# Altium project BeagleShield.PrjPcb
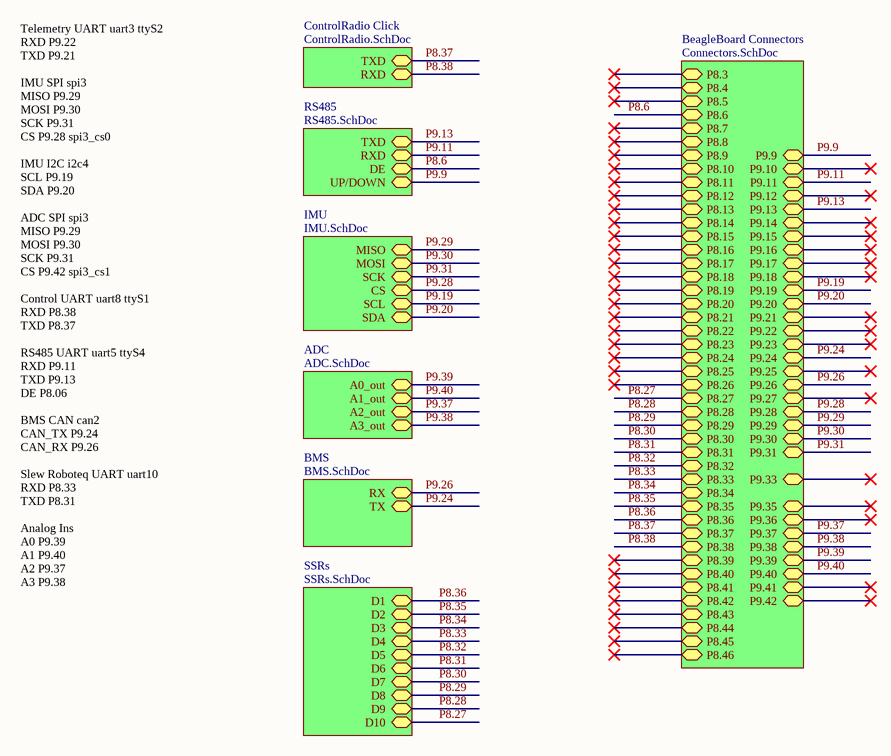
[diagram p0: Main.SchDoc]
6 sheets, 32 parts. Net scope: hierarchical (ports join the sheet entries above them; power ports are global).
Board file: Main.PcbDoc
Sheets:
  Main.SchDoc
  RS485Click.SchDoc
  TelemetryClick.SchDoc
  ADCClick.SchDoc
  Beagle.SchDoc
  ControlRadioClick.SchDoc

## Sheet Main.SchDoc
size A

### Sub-sheets
ADC = ADC.SchDoc (file not in this document): A2_out, A3_out, A0_out, A1_out
BeagleBoard Connectors = Connectors.SchDoc (file not in this document): P9.42, P9.17, P8.18, P9.21, P8.32, P9.33, P9.23, P8.28, P9.19, P9.16, P9.12, P9.31, P8.26, P9.15, P8.41, P9.36, P8.46, P8.36, P9.14, P8.12, P9.13, P9.20, P9.11, P8.20, P9.40, P8.24, P9.28, P9.30, P9.24, P9.22, P9.18, P8.22, P8.16, P8.44, P9.38, P8.38, P8.34, P9.26, P8.43, P9.25, P8.42, P9.41, P9.35, P9.27, P9.37, P9.39, P8.10, P8.30, P8.14, P8.45, P8.6, P9.29, P9.10, P8.4, P9.9, P8.8, P8.40, P8.5, P8.27, P8.3, P8.21, P8.7, P8.39, P8.19, P8.17, P8.15, P8.13, P8.35, P8.33, P8.37, P8.23, P8.9, P8.11, P8.25, P8.31, P8.29
BMS = BMS.SchDoc (file not in this document): RX, TX
ControlRadio Click = ControlRadio.SchDoc (file not in this document): TXD, RXD
IMU = IMU.SchDoc (file not in this document): MISO, MOSI, SCK, CS, SCL, SDA
RS485 = RS485.SchDoc (file not in this document): TXD, RXD, DE, UP/DOWN
SSRs = SSRs.SchDoc (file not in this document): D1, D2, D3, D4, D5, D6, D7, D8, D9, D10

### Nets
P8.6: sheet RS485/DE, sheet BeagleBoard Connectors/P8.6
P8.27: sheet BeagleBoard Connectors/P8.27, sheet SSRs/D10
P8.28: sheet BeagleBoard Connectors/P8.28, sheet SSRs/D9
P8.29: sheet BeagleBoard Connectors/P8.29, sheet SSRs/D8
P8.30: sheet BeagleBoard Connectors/P8.30, sheet SSRs/D7
P8.31: sheet BeagleBoard Connectors/P8.31, sheet SSRs/D6
P8.32: sheet BeagleBoard Connectors/P8.32, sheet SSRs/D5
P8.33: sheet BeagleBoard Connectors/P8.33, sheet SSRs/D4
P8.34: sheet BeagleBoard Connectors/P8.34, sheet SSRs/D3
P8.35: sheet BeagleBoard Connectors/P8.35, sheet SSRs/D2
P8.36: sheet BeagleBoard Connectors/P8.36, sheet SSRs/D1
P8.37: sheet BeagleBoard Connectors/P8.37, sheet ControlRadio Click/TXD
P8.38: sheet BeagleBoard Connectors/P8.38, sheet ControlRadio Click/RXD
P9.9: sheet RS485/UP/DOWN, sheet BeagleBoard Connectors/P9.9
P9.11: sheet RS485/RXD, sheet BeagleBoard Connectors/P9.11
P9.13: sheet RS485/TXD, sheet BeagleBoard Connectors/P9.13
P9.19: sheet IMU/SCL, sheet BeagleBoard Connectors/P9.19
P9.20: sheet IMU/SDA, sheet BeagleBoard Connectors/P9.20
P9.24: sheet BeagleBoard Connectors/P9.24, sheet BMS/TX
P9.26: sheet BeagleBoard Connectors/P9.26, sheet BMS/RX
P9.28: sheet IMU/CS, sheet BeagleBoard Connectors/P9.28
P9.29: sheet IMU/MISO, sheet BeagleBoard Connectors/P9.29
P9.30: sheet IMU/MOSI, sheet BeagleBoard Connectors/P9.30
P9.31: sheet IMU/SCK, sheet BeagleBoard Connectors/P9.31
P9.37: sheet ADC/A2_out, sheet BeagleBoard Connectors/P9.37
P9.38: sheet ADC/A3_out, sheet BeagleBoard Connectors/P9.38
P9.39: sheet ADC/A0_out, sheet BeagleBoard Connectors/P9.39
P9.40: sheet ADC/A1_out, sheet BeagleBoard Connectors/P9.40

### Notes on the sheet
- Telemetry UART uart3 ttyS2
  RXD P9.22
  TXD P9.21
  IMU SPI spi3
  MISO P9.29
  MOSI P9.30
  SCK P9.31
  CS P9.28 spi3_cs0
  IMU I2C i2c4
  SCL P9.19
  SDA P9.20
  ADC SPI spi3
  MISO P9.29
  MOSI P9.30
  SCK P9.31
  CS P9.42 spi3_cs1
  Control UART uart8 ttyS1
  RXD P8.38
  TXD P8.37
  RS485 UART uart5 ttyS4
  RXD P9.11
  TXD P9.13
  DE P8.06
  BMS CAN can2
  CAN_TX P9.24
  CAN_RX P9.26
  Slew Roboteq UART uart10
  RXD P8.33
  TXD P8.31
  Analog Ins
  A0 P9.39
  A1 P9.40
  A2 P9.37
  A3 P9.38

## Sheet RS485Click.SchDoc
size A
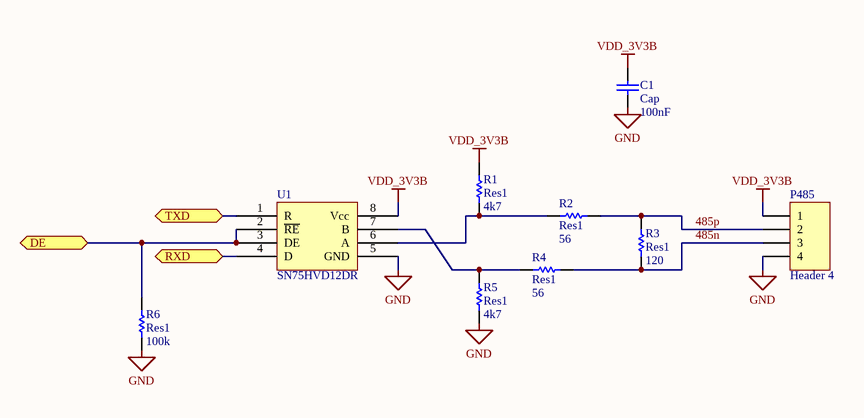
[diagram p1: RS485Click.SchDoc]

### Parts
C1  Cap  value 100nF  [RAD-0.3]
P485  Header 4  [HDR1X4]
R1  Res1  value 4k7  [AXIAL-0.3]
R2  Res1  value 56  [AXIAL-0.3]
R3  Res1  value 120  [AXIAL-0.3]
R4  Res1  value 56  [AXIAL-0.3]
R5  Res1  value 4k7  [AXIAL-0.3]
R6  Res1  value 100k  [AXIAL-0.3]
U1  SN75HVD12DR  [SOIC127P599X175-8N]

### Ports
DE, RXD, TXD

### Nets
GND: C1.1 P485.4 R5.2 R6.2 U1.5(GND)
VDD_3V3B: C1.2 P485.1 R1.1 U1.8(Vcc)
485n: P485.3 R3.1 R4.1
485p: P485.2 R2.1 R3.2
NetR1_2: R1.2 R2.2 U1.6(A)
NetR4_2: R4.2 R5.1 U1.7(B)
NetR6_1: R6.1 U1.2(~{RE}) U1.3(DE) ; port DE
NetU1_1: U1.1(R) ; port TXD
NetU1_4: U1.4(D) ; port RXD

### Library data of the parts
C1 = Cap: Capacitor; Published: 8-Jun-2000; LatestRevisionDate: 17-Jul-2002; LatestRevisionNote: Re-released for DXP Platform.; PackageReference: RAD-0.3; Publisher: Altium Limited; PackageDescription: Radial Cap, Thru-Hole; 2 Leads; 0.3 in Pin Spacing
P485 = Header 4: Header, 4-Pin; LatestRevisionDate: 17-Jul-2002; LatestRevisionNote: Re-released for DXP Platform.; Publisher: Altium Limited
R1-R6 = Res1: Resistor; Published: 8-Jun-2000; LatestRevisionDate: 17-Jul-2002; LatestRevisionNote: Re-released for DXP Platform.; PackageReference: AXIAL-0.3; Publisher: Altium Limited; PackageDescription: Axial Device, Thru-Hole; 2 Leads; 0.3 in Pin Spacing
U1 = SN75HVD12DR: Vendor Part Number: 296-26658-1-ND; Vendor: Digikey; Manufacturer Part Number: SN75HVD12DR

## Sheet TelemetryClick.SchDoc
size A
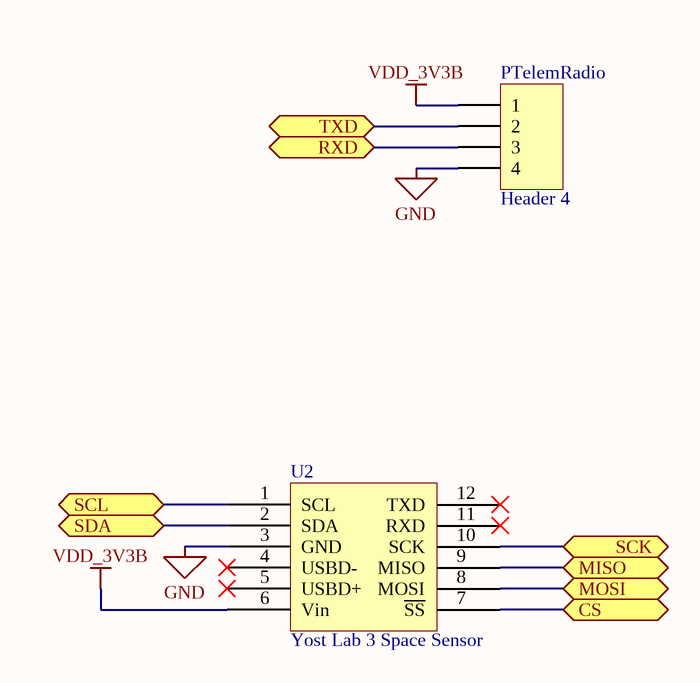
[diagram p2: TelemetryClick.SchDoc]

### Parts
PTelemRadio  Header 4  [HDR1X4]
U2  Yost Lab 3 Space Sensor  [Yost 3 Space Sensor]

### Ports
CS, MISO, MOSI, RXD, SCK, SCL, SDA, TXD

### Nets
GND: PTelemRadio.4 U2.3(GND)
VDD_3V3B: PTelemRadio.1 U2.6(Vin)
NetPTelemRadio_2: PTelemRadio.2 ; port TXD
NetPTelemRadio_3: PTelemRadio.3 ; port RXD
NetU2_1: U2.1(SCL) ; port SCL
NetU2_2: U2.2(SDA) ; port SDA
NetU2_7: U2.7(~{SS}) ; port CS
NetU2_8: U2.8(MOSI) ; port MOSI
NetU2_9: U2.9(MISO) ; port MISO
NetU2_10: U2.10(SCK) ; port SCK

Not connected (* = marked no-connect by the designer): U2 4(USBD-)* 5(USBD+)* 11(RXD)* 12(TXD)*

### Library data of the parts
PTelemRadio = Header 4: Header, 4-Pin; LatestRevisionDate: 17-Jul-2002; LatestRevisionNote: Re-released for DXP Platform.; Publisher: Altium Limited
U2 = Yost Lab 3 Space Sensor: Manufacturer Part Number: Yost Lab 3 Space Sensor

## Sheet ADCClick.SchDoc
size A
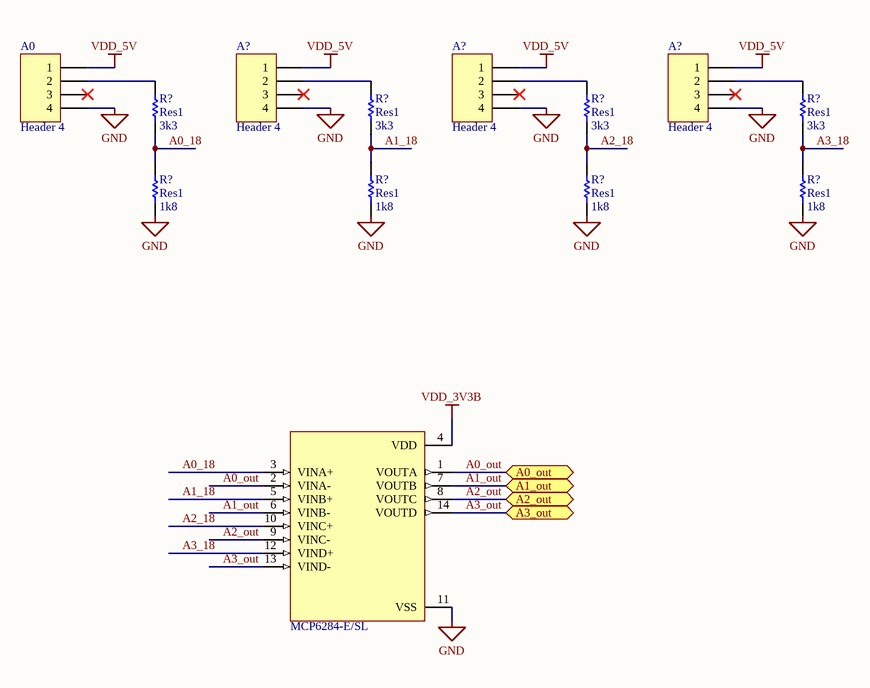
[diagram p3: ADCClick.SchDoc]

### Parts
(Parts that share a designator on the sheet are numbered #1, #2 ... from top to bottom, then left to right.)
A0  Header 4  [HDR1X4]
A?#1  Header 4  [HDR1X4]
A?#2  Header 4  [HDR1X4]
A?#3  Header 4  [HDR1X4]
R?#1  Res1  value 3k3  [AXIAL-0.3]
R?#2  Res1  value 3k3  [AXIAL-0.3]
R?#3  Res1  value 3k3  [AXIAL-0.3]
R?#4  Res1  value 3k3  [AXIAL-0.3]
R?#5  Res1  value 1k8  [AXIAL-0.3]
R?#6  Res1  value 1k8  [AXIAL-0.3]
R?#7  Res1  value 1k8  [AXIAL-0.3]
R?#8  Res1  value 1k8  [AXIAL-0.3]
U8  MCP6284-E/SL  [SOIC127P600X175-14N]

### Ports
A0_out, A1_out, A2_out, A3_out

### Nets
GND: A0.4 A?#1.4 A?#2.4 A?#3.4 R?#5.2 R?#6.2 R?#7.2 R?#8.2 U8.11(VSS)
VDD_3V3B: U8.4(VDD)
VDD_5V: A0.1 A?#1.1 A?#2.1 A?#3.1
A0_18: R?#1.2 R?#5.1 U8.3(VINA+)
A0_out: U8.1(VOUTA) U8.2(VINA-) ; port A0_out
A1_18: R?#2.2 R?#6.1 U8.5(VINB+)
A1_out: U8.6(VINB-) U8.7(VOUTB) ; port A1_out
A2_18: R?#3.2 R?#7.1 U8.10(VINC+)
A2_out: U8.8(VOUTC) U8.9(VINC-) ; port A2_out
A3_18: R?#4.2 R?#8.1 U8.12(VIND+)
A3_out: U8.13(VIND-) U8.14(VOUTD) ; port A3_out
NetA0_2: A0.2 R?#1.1
NetA?#1_2: A?#1.2 R?#2.1
NetA?#2_2: A?#2.2 R?#3.1
NetA?#3_2: A?#3.2 R?#4.1

Not connected (* = marked no-connect by the designer): A0 3*; A?#1 3*; A?#2 3*; A?#3 3*

### Library data of the parts
A0 A?#1-A?#3 = Header 4: Header, 4-Pin; LatestRevisionDate: 17-Jul-2002; LatestRevisionNote: Re-released for DXP Platform.; Publisher: Altium Limited
R?#1-R?#8 = Res1: Resistor; Published: 8-Jun-2000; LatestRevisionDate: 17-Jul-2002; LatestRevisionNote: Re-released for DXP Platform.; PackageReference: AXIAL-0.3; Publisher: Altium Limited; PackageDescription: Axial Device, Thru-Hole; 2 Leads; 0.3 in Pin Spacing
U8 = MCP6284-E/SL: General Purpose Amplifier 4 Circuit Rail-to-Rail 14-SOIC; Vendor Part Number: MCP6284-E/SL-ND; MF: Microchip

## Sheet Beagle.SchDoc
size A
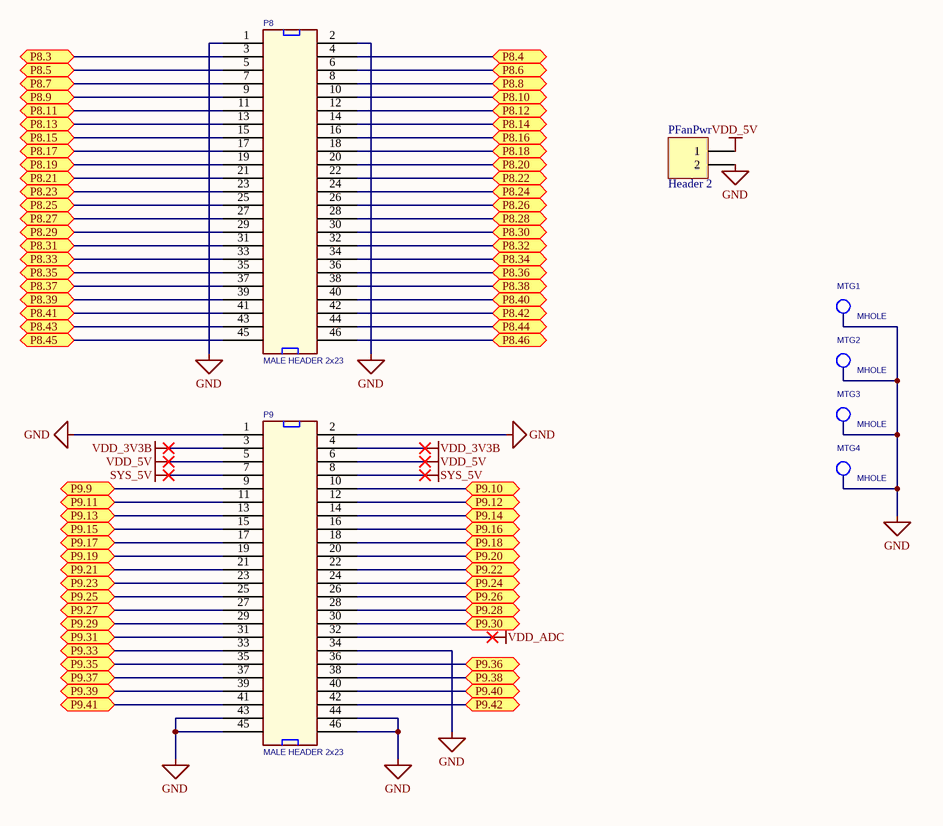
[diagram p4: Beagle.SchDoc]

### Parts
MTG1  MHOLE  [MTGH200C125D_PL]  (no BOM)
MTG2  MHOLE  [MTGH200C125D_PL]  (no BOM)
MTG3  MHOLE  [MTGH200C125D_PL]  (no BOM)
MTG4  MHOLE  [MTGH200C125D_PL]  (no BOM)
P8  MALE HEADER 2x23  [95278-101B46LF]
P9  MALE HEADER 2x23  [95278-101B46LF]
PFanPwr  Header 2  [HDR1X2]

### Ports
P8.3, P8.4, P8.5, P8.6, P8.7, P8.8, P8.9, P8.10, P8.11, P8.12, P8.13, P8.14, P8.15, P8.16, P8.17, P8.18, P8.19, P8.20, P8.21, P8.22, P8.23, P8.24, P8.25, P8.26, P8.27, P8.28, P8.29, P8.30, P8.31, P8.32, P8.33, P8.34, P8.35, P8.36, P8.37, P8.38, P8.39, P8.40, P8.41, P8.42, P8.43, P8.44, P8.45, P8.46, P9.9, P9.10, P9.11, P9.12, P9.13, P9.14, P9.15, P9.16, P9.17, P9.18, P9.19, P9.20, P9.21, P9.22, P9.23, P9.24, P9.25, P9.26, P9.27, P9.28, P9.29, P9.30, P9.31, P9.33, P9.35, P9.36, P9.37, P9.38, P9.39, P9.40, P9.41, P9.42

### Nets
GND: MTG1.1(TP) MTG2.1(TP) MTG3.1(TP) MTG4.1(TP) P8.1 P8.2 P9.1 P9.2 P9.34 P9.43 P9.44 P9.45 P9.46 PFanPwr.2
SYS_5V: P9.7 P9.8
VDD_3V3B: P9.3 P9.4
VDD_5V: P9.5 P9.6 PFanPwr.1
VDD_ADC: P9.32
NetP8_3: P8.3 ; port P8.3
NetP8_4: P8.4 ; port P8.4
NetP8_5: P8.5 ; port P8.5
NetP8_6: P8.6 ; port P8.6
NetP8_7: P8.7 ; port P8.7
NetP8_8: P8.8 ; port P8.8
NetP8_9: P8.9 ; port P8.9
NetP8_10: P8.10 ; port P8.10
NetP8_11: P8.11 ; port P8.11
NetP8_12: P8.12 ; port P8.12
NetP8_13: P8.13 ; port P8.13
NetP8_14: P8.14 ; port P8.14
NetP8_15: P8.15 ; port P8.15
NetP8_16: P8.16 ; port P8.16
NetP8_17: P8.17 ; port P8.17
NetP8_18: P8.18 ; port P8.18
NetP8_19: P8.19 ; port P8.19
NetP8_20: P8.20 ; port P8.20
NetP8_21: P8.21 ; port P8.21
NetP8_22: P8.22 ; port P8.22
NetP8_23: P8.23 ; port P8.23
NetP8_24: P8.24 ; port P8.24
NetP8_25: P8.25 ; port P8.25
NetP8_26: P8.26 ; port P8.26
NetP8_27: P8.27 ; port P8.27
NetP8_28: P8.28 ; port P8.28
NetP8_29: P8.29 ; port P8.29
NetP8_30: P8.30 ; port P8.30
NetP8_31: P8.31 ; port P8.31
NetP8_32: P8.32 ; port P8.32
NetP8_33: P8.33 ; port P8.33
NetP8_34: P8.34 ; port P8.34
NetP8_35: P8.35 ; port P8.35
NetP8_36: P8.36 ; port P8.36
NetP8_37: P8.37 ; port P8.37
NetP8_38: P8.38 ; port P8.38
NetP8_39: P8.39 ; port P8.39
NetP8_40: P8.40 ; port P8.40
NetP8_41: P8.41 ; port P8.41
NetP8_42: P8.42 ; port P8.42
NetP8_43: P8.43 ; port P8.43
NetP8_44: P8.44 ; port P8.44
NetP8_45: P8.45 ; port P8.45
NetP8_46: P8.46 ; port P8.46
NetP9_9: P9.9 ; port P9.9
NetP9_10: P9.10 ; port P9.10
NetP9_11: P9.11 ; port P9.11
NetP9_12: P9.12 ; port P9.12
NetP9_13: P9.13 ; port P9.13
NetP9_14: P9.14 ; port P9.14
NetP9_15: P9.15 ; port P9.15
NetP9_16: P9.16 ; port P9.16
NetP9_17: P9.17 ; port P9.17
NetP9_18: P9.18 ; port P9.18
NetP9_19: P9.19 ; port P9.19
NetP9_20: P9.20 ; port P9.20
NetP9_21: P9.21 ; port P9.21
NetP9_22: P9.22 ; port P9.22
NetP9_23: P9.23 ; port P9.23
NetP9_24: P9.24 ; port P9.24
NetP9_25: P9.25 ; port P9.25
NetP9_26: P9.26 ; port P9.26
NetP9_27: P9.27 ; port P9.27
NetP9_28: P9.28 ; port P9.28
NetP9_29: P9.29 ; port P9.29
NetP9_30: P9.30 ; port P9.30
NetP9_31: P9.31 ; port P9.31
NetP9_33: P9.33 ; port P9.33
NetP9_35: P9.35 ; port P9.35
NetP9_36: P9.36 ; port P9.36
NetP9_37: P9.37 ; port P9.37
NetP9_38: P9.38 ; port P9.38
NetP9_39: P9.39 ; port P9.39
NetP9_40: P9.40 ; port P9.40
NetP9_41: P9.41 ; port P9.41
NetP9_42: P9.42 ; port P9.42

### Library data of the parts
P8 P9 = HDR_46_F_2_0.1_0.1: CONN HEADER FMAL 46PS.1" DL GOLD; Manufacturer: Sullins Connector Solutions; Number of Positions: 46; Number of Positions Loaded: All; Pitch: 0.100" (2.54mm); Supplier 1: Digi-Key; Supplier Part Number 1: S7126-ND; RoHS: RoHS Compliant; Category: Connectors, Interconnects; Stock 1: 750; Pricing 1: 1=2.75, 10=2.325, 25=2.2196, 50=2.0084, 100=1.7969, 250=1.58552, 500=1.4798, 1000=1.3741, 2500=1.32125 (USD); Connector Type: Header; Contact Type: Female Socket; Number of Rows: 2; Row Spacing: 0.100" (2.54mm); Mounting Type: Through Hole; Termination: Solder; Fastening Type: -; Features: -; Contact Finish: Gold; Contact Finish Thickness: Flash; Color: Black; Packaging: Bulk; ComponentLink1URL: http://www.sullinscorp.com/drawings/78_P(N)PxCxxxLFBN-RC,_10492-G.pdf; ComponentLink1Description: http://www.sullinscorp.com/drawings/78_P(N)PxCxxxLFBN-RC,_10492-G.pdf
PFanPwr = Header 2: Header, 2-Pin; LatestRevisionDate: 17-Jul-2002; LatestRevisionNote: Re-released for DXP Platform.; Publisher: Altium Limited

## Sheet ControlRadioClick.SchDoc
size A
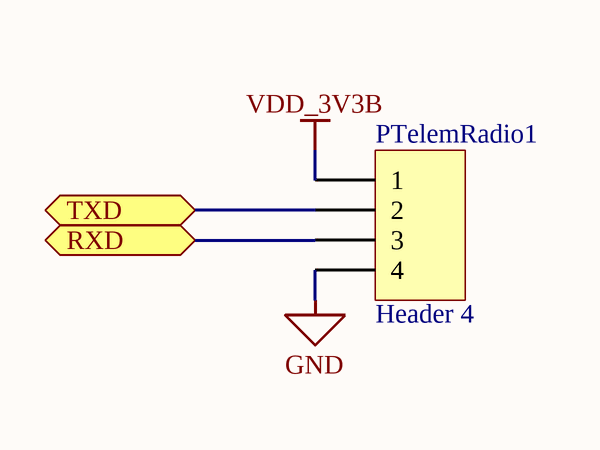
[diagram p5: ControlRadioClick.SchDoc]

### Parts
PTelemRadio1  Header 4  [HDR1X4]

### Ports
RXD, TXD

### Nets
GND: PTelemRadio1.4
VDD_3V3B: PTelemRadio1.1
NetPTelemRadio1_2: PTelemRadio1.2 ; port TXD
NetPTelemRadio1_3: PTelemRadio1.3 ; port RXD

### Library data of the parts
PTelemRadio1 = Header 4: Header, 4-Pin; LatestRevisionDate: 17-Jul-2002; LatestRevisionNote: Re-released for DXP Platform.; Publisher: Altium Limited

## Nets that join several sheets
GND: RS485Click (5 pins), TelemetryClick (PTelemRadio.4 U2.3), ADCClick (9 pins), Beagle (14 pins), ControlRadioClick (PTelemRadio1.4)
VDD_3V3B: RS485Click (C1.2 P485.1 R1.1 U1.8), TelemetryClick (PTelemRadio.1 U2.6), ADCClick (U8.4), Beagle (P9.3 P9.4), ControlRadioClick (PTelemRadio1.1)
VDD_5V: ADCClick (A0.1 A?#1.1 A?#2.1 A?#3.1), Beagle (P9.5 P9.6 PFanPwr.1)